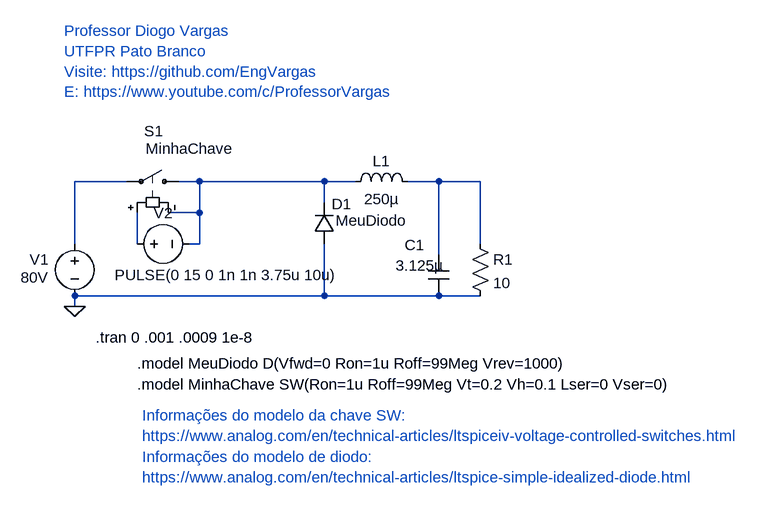
[diagram p0: schematic Conv-A03-Buck_CCM_(LTspice_ideal).asc]
Conv-A03-Buck_CCM_(LTspice_ideal).asc, the LTspice schematic file:
Version 4
SHEET 1 1256 680
WIRE 176 -64 96 -64
WIRE 288 -64 256 -64
WIRE 480 -64 288 -64
WIRE 528 -64 480 -64
WIRE 656 -64 608 -64
WIRE 720 -64 656 -64
WIRE 480 -32 480 -64
WIRE 288 -16 288 -64
WIRE 288 -16 240 -16
WIRE 96 32 96 -64
WIRE 192 32 192 -16
WIRE 288 32 288 -16
WIRE 288 32 272 32
WIRE 720 32 720 -64
WIRE 656 48 656 -64
WIRE 480 112 480 32
WIRE 480 112 96 112
WIRE 656 112 480 112
WIRE 720 112 656 112
WIRE 96 128 96 112
FLAG 96 128 0
SYMBOL voltage 96 16 R0
WINDOW 3 -83 68 Left 2
WINDOW 0 -69 40 Left 2
WINDOW 123 0 0 Left 0
WINDOW 39 0 0 Left 0
SYMATTR Value 80V
SYMATTR InstName V1
SYMBOL voltage 176 32 R270
WINDOW 0 32 56 VTop 2
WINDOW 3 -32 154 VBottom 2
WINDOW 123 0 0 Left 2
WINDOW 39 0 0 Left 2
SYMATTR InstName V2
SYMATTR Value PULSE(0 15 0 1n 1n 3.75u 10u)
SYMBOL ind 512 -48 R270
WINDOW 0 32 56 VTop 2
WINDOW 3 5 56 VBottom 2
SYMATTR InstName L1
SYMATTR Value 250µ
SYMBOL cap 640 48 R0
WINDOW 0 -36 -14 Left 2
WINDOW 3 -50 17 Left 2
SYMATTR InstName C1
SYMATTR Value 3.125µ
SYMBOL res 704 16 R0
SYMATTR InstName R1
SYMATTR Value 10
SYMBOL diode 496 32 R180
WINDOW 0 -26 61 Left 2
WINDOW 3 -112 36 Left 2
SYMATTR InstName D1
SYMATTR Value MeuDiodo
SYMBOL sw 272 -64 M270
WINDOW 0 78 69 VLeft 2
WINDOW 3 51 67 VLeft 2
SYMATTR InstName S1
SYMATTR Value MinhaChave
TEXT 128 176 Left 2 !.tran 0 .001 .0009 1e-8
TEXT 192 216 Left 2 !.model MeuDiodo D(Vfwd=0 Ron=1u Roff=99Meg Vrev=1000)
TEXT 192 248 Left 2 !.model MinhaChave SW(Ron=1u Roff=99Meg Vt=0.2 Vh=0.1 Lser=0 Vser=0)
TEXT 200 296 Left 2 ;Informações do modelo da chave SW:\nhttps://www.analog.com/en/technical-articles/ltspiceiv-voltage-controlled-switches.html
TEXT 200 360 Left 2 ;Informações do modelo de diodo:\nhttps://www.analog.com/en/technical-articles/ltspice-simple-idealized-diode.html
TEXT 80 -296 Left 2 ;Professor Diogo Vargas\nUTFPR Pato Branco\nVisite: https://github.com/EngVargas\nE: https://www.youtube.com/c/ProfessorVargas

The netlist it stands for:
* Conv-A03-Buck_CCM_(LTspice_ideal).asc
V1 N001 0 80V
V2 N004 N002 PULSE(0 15 0 1n 1n 3.75u 10u)
L1 N002 N003 250µ
C1 N003 0 3.125µ
R1 N003 0 10
D1 0 N002 MeuDiodo
S1 N002 N001 N004 N002 MinhaChave
.model D D
.lib standard.dio
.tran 0 .001 .0009 1e-8
.model MeuDiodo D(Vfwd=0 Ron=1u Roff=99Meg Vrev=1000)
.model MinhaChave SW(Ron=1u Roff=99Meg Vt=0.2 Vh=0.1 Lser=0 Vser=0)
* Informações do modelo da chave SW:
* https://www.analog.com/en/technical-articles/ltspiceiv-voltage-controlled-switches.html
* Informações do modelo de diodo:
* https://www.analog.com/en/technical-articles/ltspice-simple-idealized-diode.html
* Professor Diogo Vargas
* UTFPR Pato Branco
* Visite: https://github.com/EngVargas
* E: https://www.youtube.com/c/ProfessorVargas
.backanno
.end